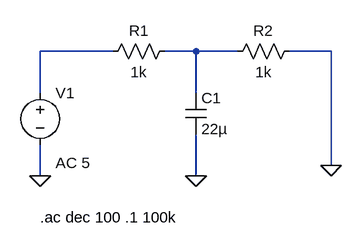
[diagram p0: schematic Draft3.asc]
Draft3.asc, the LTspice schematic file:
Version 4
SHEET 1 880 680
WIRE 80 144 -32 144
WIRE 208 144 160 144
WIRE 272 144 208 144
WIRE 416 144 352 144
WIRE -32 208 -32 144
WIRE 208 208 208 144
WIRE 416 320 416 144
WIRE -32 336 -32 288
WIRE 208 336 208 272
FLAG -32 336 0
FLAG 208 336 0
FLAG 416 320 0
SYMBOL res 176 128 R90
WINDOW 0 0 56 VBottom 2
WINDOW 3 32 56 VTop 2
SYMATTR InstName R1
SYMATTR Value 1k
SYMATTR SpiceLine tol=1 pwr=0.1
SYMBOL cap 192 208 R0
SYMATTR InstName C1
SYMATTR Value 22µ
SYMATTR SpiceLine V=4 Irms=0 Rser=0 Lser=0
SYMBOL voltage -32 192 R0
WINDOW 123 24 124 Left 2
WINDOW 39 0 0 Left 0
SYMATTR InstName V1
SYMATTR Value ""
SYMATTR Value2 AC 5
SYMBOL res 368 128 R90
WINDOW 0 0 56 VBottom 2
WINDOW 3 32 56 VTop 2
SYMATTR InstName R2
SYMATTR Value 1k
TEXT -32 400 Left 2 !.ac dec 100 .1 100k

The netlist it stands for:
* Draft3.asc
R1 N002 N001 1k tol=1 pwr=0.1
C1 N002 0 22µ V=4 Irms=0 Rser=0 Lser=0
V1 N001 0 AC 5
R2 0 N002 1k
.ac dec 100 .1 100k
.backanno
.end